# Altium schematic sheet Carte_MiniPAMI 2025.SchDoc
size A4; Author: Audran; CompanyName: Goldorak; Address1: Electrolab; Address2: 52 rue Paul Lescop; Address3: 92000 Nanterre; DocumentNumber: 1; SheetNumber: 1; SheetTotal: 5; ProjectName: Cartes_2017
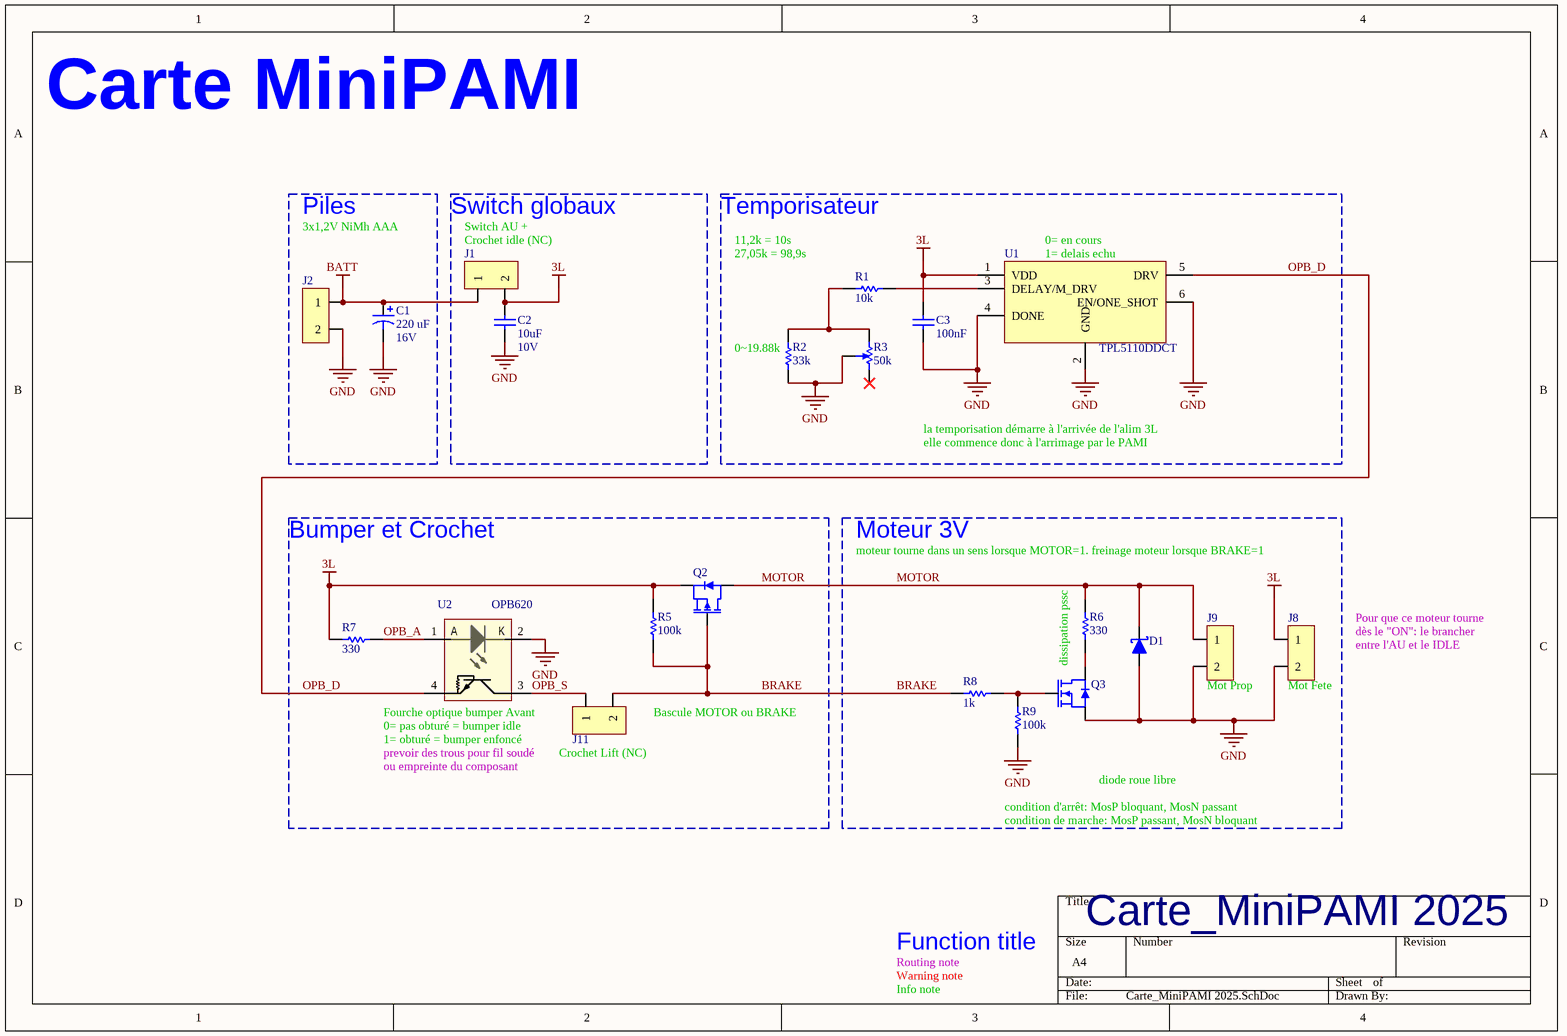
[diagram p0: Carte_MiniPAMI 2025.SchDoc]

## Parts
C1  220 uF  RatedVoltage: 16V  [WCAP-ATG8_6.3x11x2.5x0.5]
C2  10uF  RatedVoltage: 10V  [WCAP-CSGP_0805, 2x1.25x1.25]
C3  100nF  [WCAP-CSGP_0603, 1.6x0.8x0.8]
D1  RBR3MM40ATFTR  [SOD-123FL]  (value not drawn)
J1  22-03-2021  [Conn_22-03-2021]  (value not drawn)
J2  22-03-2021  [Conn_22-03-2021]  (value not drawn)
J8  22-03-2021  [Conn_22-03-2021]  (value not drawn)
J9  22-03-2021  [Conn_22-03-2021]  (value not drawn)
J11  22-03-2021  [Conn_22-03-2021]  (value not drawn)
Q2  ZXM61P03FTA  [SOT-23]  (value not drawn)
Q3  IRLML0040TRPBF  [SOT-23]  (value not drawn)
R1  value 10k  [RESC1608X06N]  (hidden comment: RC0603FR-0710KL)
R2  value 33k  [RESC1608X06N]
R3  value 50k  [TRIM_PANASONIC_EVM-2W]  (hidden comment: EVM2WSX80B54)
R5  value 100k  [RESC1608X06N]  (hidden comment: RC0603FR-07100KL)
R6  value 330  [RESC1608X06N]  (hidden comment: RC0603FR-07330RL)
R7  value 330  [RESC1608X06N]  (hidden comment: RC0603FR-07330RL)
R8  value 1k  [RESC1608X06N]  (hidden comment: RC0603FR-071KL)
R9  value 100k  [RESC1608X06N]  (hidden comment: RC0603FR-07100KL)
U1  TPL5110DDCT  [SOT23_95P280X145-6N]
U2  OPB620  [OPB620]

## Blocks framed on the sheet
Piles: C1 J2
Switch globaux: C2 J1
Temporisateur: C3 R1-R3 U1
Bumper et Crochet: J11 Q2 R5 R7 U2
Moteur 3V: D1 J8 J9 Q3 R6 R8 R9

## Nets
3L: C2.1 C3.1 J1.2 J8.1 Q2.2(S) R5.2 R7.1 U1.1(VDD)
BATT: C1.1 J1.1 J2.1
GND: C1.2 C2.2 C3.2 D1.1 J2.2 J8.2 J9.2 Q3.2(S) R2.2 R3.2 R9.1 U1.2(GND) U1.4(DONE) U1.6(EN/ONE_SHOT) U2.2(LED_K)
BRAKE: J11.2 Q2.1(G) R5.1 R8.2
MOTOR: D1.2 J9.1 Q2.3(D) R6.2
OPB_A: R7.2 U2.1(LED_A)
OPB_D: U1.5(DRV) U2.4(NPN_E)
OPB_S: J11.1 U2.3(NPN_C)
NetQ3_1: Q3.1(G) R8.1 R9.2
NetQ3_3: Q3.3(D) R6.1
NetR1_1: R1.1 R2.1 R3.1
NetR1_2: R1.2 U1.3(DELAY/M_DRV)

Not connected (* = marked no-connect by the designer): R3 3*

## Notes on the sheet
- Carte MiniPAMI
- 3x1,2V NiMh AAA
- Switch AU +
- (near J1) Crochet idle (NC)
- 11,2k = 10s
- (near U1) 0= en cours
- (near R1) 27,05k = 98,9s
- (near U1) 1= delais echu
- (near R2) 0~19.88k
- la temporisation démarre à l'arrivée de l'alim 3L
- elle commence donc à l'arrimage par le PAMI
- moteur tourne dans un sens lorsque MOTOR=1. freinage moteur lorsque BRAKE=1
- Pour que ce moteur tourne
- dès le "ON": le brancher
- entre l'AU et le IDLE
- (near U2) Fourche optique bumper Avant
- (near J11) Bascule MOTOR ou BRAKE
- dissipation pssc
- (near J9) Mot Prop
- (near J8) Mot Fete
- prevoir des trous pour fil soudé
- ou empreinte du composant
- 0= pas obturé = bumper idle
- 1= obturé = bumper enfoncé
- (near J11) Crochet Lift (NC)
- diode roue libre
- condition d'arrêt: MosP bloquant, MosN passant
- condition de marche: MosP passant, MosN bloquant
- Routing note
- Warning note
- Function title
- Carte_MiniPAMI 2025
- Info note
- (in symbol OPB620) A; K

## Library data of the parts
C1 = WCAP-ATG8, 860010373010: CAP Alu 220 UF 20% 16 V; Manufacturer: Wurth Elektronik; ComponentLink1Description: Datasheet; ComponentLink1URL: http://katalog.we-online.de/pbs/datasheet/860010373010.pdf; Manufacturer Part Number: 860010373010; Value: 220 uF; Size: 6.3mmx11mm
C2 = WCAP-CSGP, 885012207026: CAP CER 10uF 10V X7R 0805; Manufacturer: Wurth Elektronik; ComponentLink1Description: Datasheet; ComponentLink1URL: http://katalog.we-online.com/pbs/datasheet/885012207026.pdf; Value: 10uF; Size: 0805; CeramicType: X7R; Manufacturer Part Number: 885012207026; Supplier 2: JLCPCB; Supplier Part Number 2: C15850; Supplier 1: Farnell; Supplier Part Number 1: 2495189; Supplier Footprint 2: 0805
C3 = WCAP-CSGP, 885012206095: CAP CER 100nF 50V X7R 0603; Manufacturer: Wurth Elektronik; ComponentLink1Description: Datasheet; ComponentLink1URL: http://katalog.we-online.com/pbs/datasheet/885012206095.pdf; Manufacturer Part Number: 885012206095; Value: 100nF; Size: 0603; CeramicType: X7R; Supplier 2: JLCPCB; Supplier Part Number 2: C14663; RatedVoltage: 50V; Supplier Footprint 2: 0603; Supplier 1: Farnell; Supplier Part Number 1: 2495187
D1 = RBR3MM40ATFTR: DIODE SCHOTTKY 40V 3A SOD123-FL; Manufacturer: ROHM; Supplier 1: Farnell; Manufacturer Part Number: RBR3MM40ATFTR; ComponentLink1URL: http://www.farnell.com/datasheets/2067190.pdf; ComponentLink1Description: Datasheet; Supplier Part Number 1: 2581593; ComponentLink2Description: Manufacturer; ComponentLink2URL: http://www.rohm.com/web/global/products/-/product/RBR3MM40ATF; ContinuousForwardCurrent: 3A; Type: Schottky; Supplier 2: JLCPCB; Supplier Part Number 2: C8598; Value: 40V; Supplier Footprint 2: SOD-123
J1 J2 J8 J9 J11 = Conn_22-03-2021: CONN HEADER VERT 2POS 2.54MM; Manufacturer: MOLEX; Supplier 1: Farnell; Supplier Part Number 1: 9731075; Manufacturer Part Number: 22-03-2021; ComponentLink1URL: http://www.farnell.com/datasheets/1791308.pdf; ComponentLink1Description: Datasheet; ComponentLink2URL: http://www.farnell.com/cad/495071.pdf  http://www.farnell.com/cad/1533907.pdf  http://www.farnell.com/cad/1533907.pdf; ComponentLink2Description: Drawings
Q2 = ZXM61P03FTA: MOSFET P-CH 30V 1.1A SOT23-3; Manufacturer: Diodes Incorporated; Manufacturer Part Number: ZXM61P03FTA; ComponentLink1Description: Datasheet; ComponentLink1URL: https://www.diodes.com/assets/Datasheets/ZXM61P03F.pdf; Supplier Footprint 2: SOT-23-3; Supplier 2: JLCPCB; Supplier 1: Rs; Supplier Part Number 2: C156274; Supplier Part Number 1: 9227673; Supplier 3: Evolutek
Q3 = IRLML0040: MOSFET N 40V 3.6A SOT23; Manufacturer: INTERNATIONAL RECTIFIER; Supplier 1: Farnell; Supplier Part Number 1: 1831088; Manufacturer Part Number: IRLML0040TRPBF; ComponentLink1Description: Datasheet; ComponentLink1URL: http://www.irf.com/product-info/datasheets/data/irlml0040pbf.pdf
R1 = RC0603FR-0710KL: RES SMD 10K OHM 1% 1/10W 0603; Manufacturer: Yageo; Power: 100mW; Vmax: 50V; Manufacturer Part Number: RC0603FR-0710KL; Type: Thick Film; ComponentLink1Description: Manufacturer; ComponentLink1URL: http://www.yageo.com/NewPortal/_en/index.jsp; ComponentLink2Description: Datasheet; ComponentLink2URL: http://www.farnell.com/datasheets/2167052.pdf; Supplier 1: Farnell; Supplier Part Number 1: 9238603; Precision: ±1%; Supplier 2: JLCPCB; Supplier Part Number 2: C25804; Supplier Footprint 2: 0603
R2 = RC0603FR-0710KL: RES SMD 33K OHM 1% 1/10W 0603; Manufacturer: Yageo; Power: 100mW; Vmax: 50V; Type: Thick Film; ComponentLink1Description: Manufacturer; ComponentLink1URL: http://www.yageo.com/NewPortal/_en/index.jsp; ComponentLink2Description: Datasheet; ComponentLink2URL: http://www.farnell.com/datasheets/2167052.pdf; Supplier 1: Farnell; Supplier Part Number 1: 9238603; Precision: ±1%; Supplier 2: JLCPCB; Supplier Part Number 2: C25804; Supplier Footprint 2: 0603
R3 = EVM2WSX80B54: TRIMMER 50K OHM 0.15W SMD; Manufacturer: PANASONIC ELECTRONIC COMPONENTS; Power: 150mW; Manufacturer Part Number: EVM2WSX80B54; ComponentLink1Description: Datasheet; ComponentLink1URL: http://www.farnell.com/datasheets/2244143.pdf; Supplier 1: Farnell; Supplier Part Number 1: 1849775
R5 R9 = RC0603FR-07100KL: RES SMD 100K OHM 1% 1/10W 0603; Manufacturer: Yageo; Power: 100mW; Vmax: 50V; Manufacturer Part Number: RC0603FR-07100KL; Type: Thick Film; ComponentLink1Description: Manufacturer; ComponentLink1URL: http://www.yageo.com/NewPortal/_en/index.jsp; ComponentLink2Description: Datasheet; ComponentLink2URL: http://www.farnell.com/datasheets/2167052.pdf; Supplier 1: Farnell; Supplier Part Number 1: 2309107; Precision: ±1%; Supplier 2: JLCPCB; Supplier Part Number 2: C25803; Supplier Footprint 2: 0603
R6 R7 = RC0603FR-07330RL: RES SMD 330 OHM 1% 1/10W 0603; Manufacturer: Yageo; Power: 100mW; Vmax: 50V; Manufacturer Part Number: RC0603FR-07330RL; Type: Thick Film; ComponentLink1Description: Manufacturer; ComponentLink1URL: http://www.yageo.com/NewPortal/_en/index.jsp; ComponentLink2Description: Datasheet; ComponentLink2URL: http://www.farnell.com/datasheets/2167052.pdf; Supplier 1: Farnell; Supplier Part Number 1: 9238425; Precision: ±1%; Supplier 2: JLCPCB; Supplier Part Number 2: C23138; Supplier Footprint 2: 0603
R8 = RC0603FR-071KL: RES SMD 1K OHM 1% 1/10W 0603; Manufacturer: Yageo; Power: 100mW; Vmax: 50V; Manufacturer Part Number: RC0603FR-071KL; Type: Thick Film; ComponentLink1Description: Manufacturer; ComponentLink1URL: http://www.yageo.com/NewPortal/_en/index.jsp; ComponentLink2Description: Datasheet; ComponentLink2URL: http://www.farnell.com/datasheets/2167052.pdf; Precision: ±1%; Supplier 1: Farnell; Supplier Part Number 1: 9238484; Supplier 2: JLCPCB; Supplier Part Number 2: C21190; Supplier Footprint 2: 0603
U1 = TPL5110DDCT: IC OSC PROG TIMER TSOT23-6; Manufacturer: TEXAS INSTRUMENTS; ComponentLink1URL: https://www.ti.com/lit/ds/symlink/tpl5110.pdf; ComponentLink1Description: Datasheet; Manufacturer Part Number: TPL5110DDCT; Supplier 1: Farnell; Supplier Part Number 1: 3121221; Supplier 2: LCSC; Supplier Part Number 2: C125830
U2 = OPB620: SENSOR OPT SLOT TRANS W/RES PCB; Manufacturer: TT ELECTRONICS; Manufacturer Part Number: OPB620; ComponentLink1URL: http://www.farnell.com/datasheets/2702441.pdf; ComponentLink1Description: Datasheet; Supplier 1: Farnell; Supplier Part Number 1: 491330